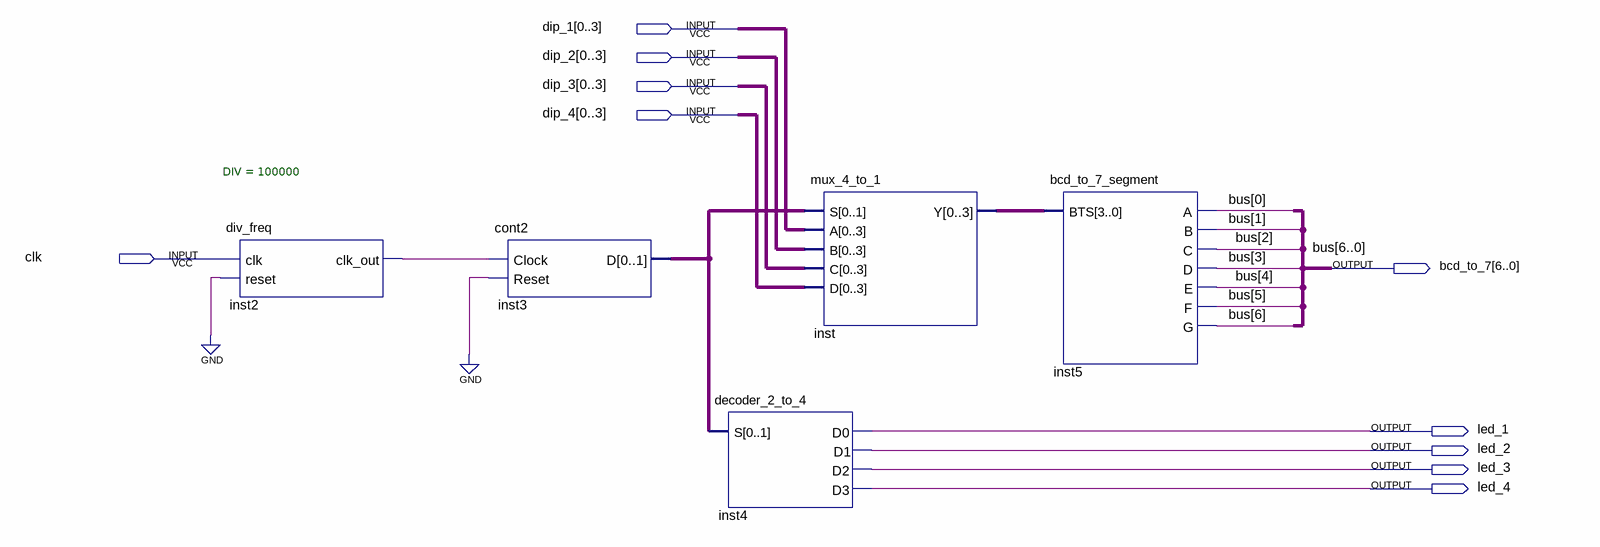
[diagram p0: schematic sheet]
// Quartus schematic practica2.bdf as structural Verilog: 5 symbols, 10 pins
module practica2 (
  input  [0:3] dip_1,
  input  [0:3] dip_2,
  input  [0:3] dip_3,
  input  [0:3] dip_4,
  input  clk,
  output [6:0] bcd_to_7,
  output led_1,
  output led_2,
  output led_3,
  output led_4
);

  wire inst2_clk_out;
  wire [1:0] inst3_d;
  wire [3:0] inst_y;

  div_freq #(.DIV(100000)) inst2 (.clk(clk), .reset(1'b0), .clk_out(inst2_clk_out));
  cont2 inst3 (.Clock(inst2_clk_out), .Reset(1'b0), .D(inst3_d));
  decoder_2_to_4 inst4 (.S(inst3_d), .D0(led_1), .D1(led_2), .D2(led_3), .D3(led_4));
  mux_4_to_1 inst (.S(inst3_d), .A(dip_1), .B(dip_2), .C(dip_3), .D(dip_4), .Y(inst_y));
  bcd_to_7_segment inst5 (
    .BTS(inst_y), .A(bcd_to_7[0]), .B(bcd_to_7[1]), .C(bcd_to_7[2]), .D(bcd_to_7[3]), .E(bcd_to_7[4]),
    .F(bcd_to_7[5]), .G(bcd_to_7[6]));

  // Other names for the same wires on the sheet: bus[6:0] = bcd_to_7
endmodule
